# EasyEDA schematic d_00_e_03.json
TITLE: Sheet_1; REV: 1.0; Date: 2021-02-06; Sheet: 1/1; Drawn By: ghusk; Company: Your Company
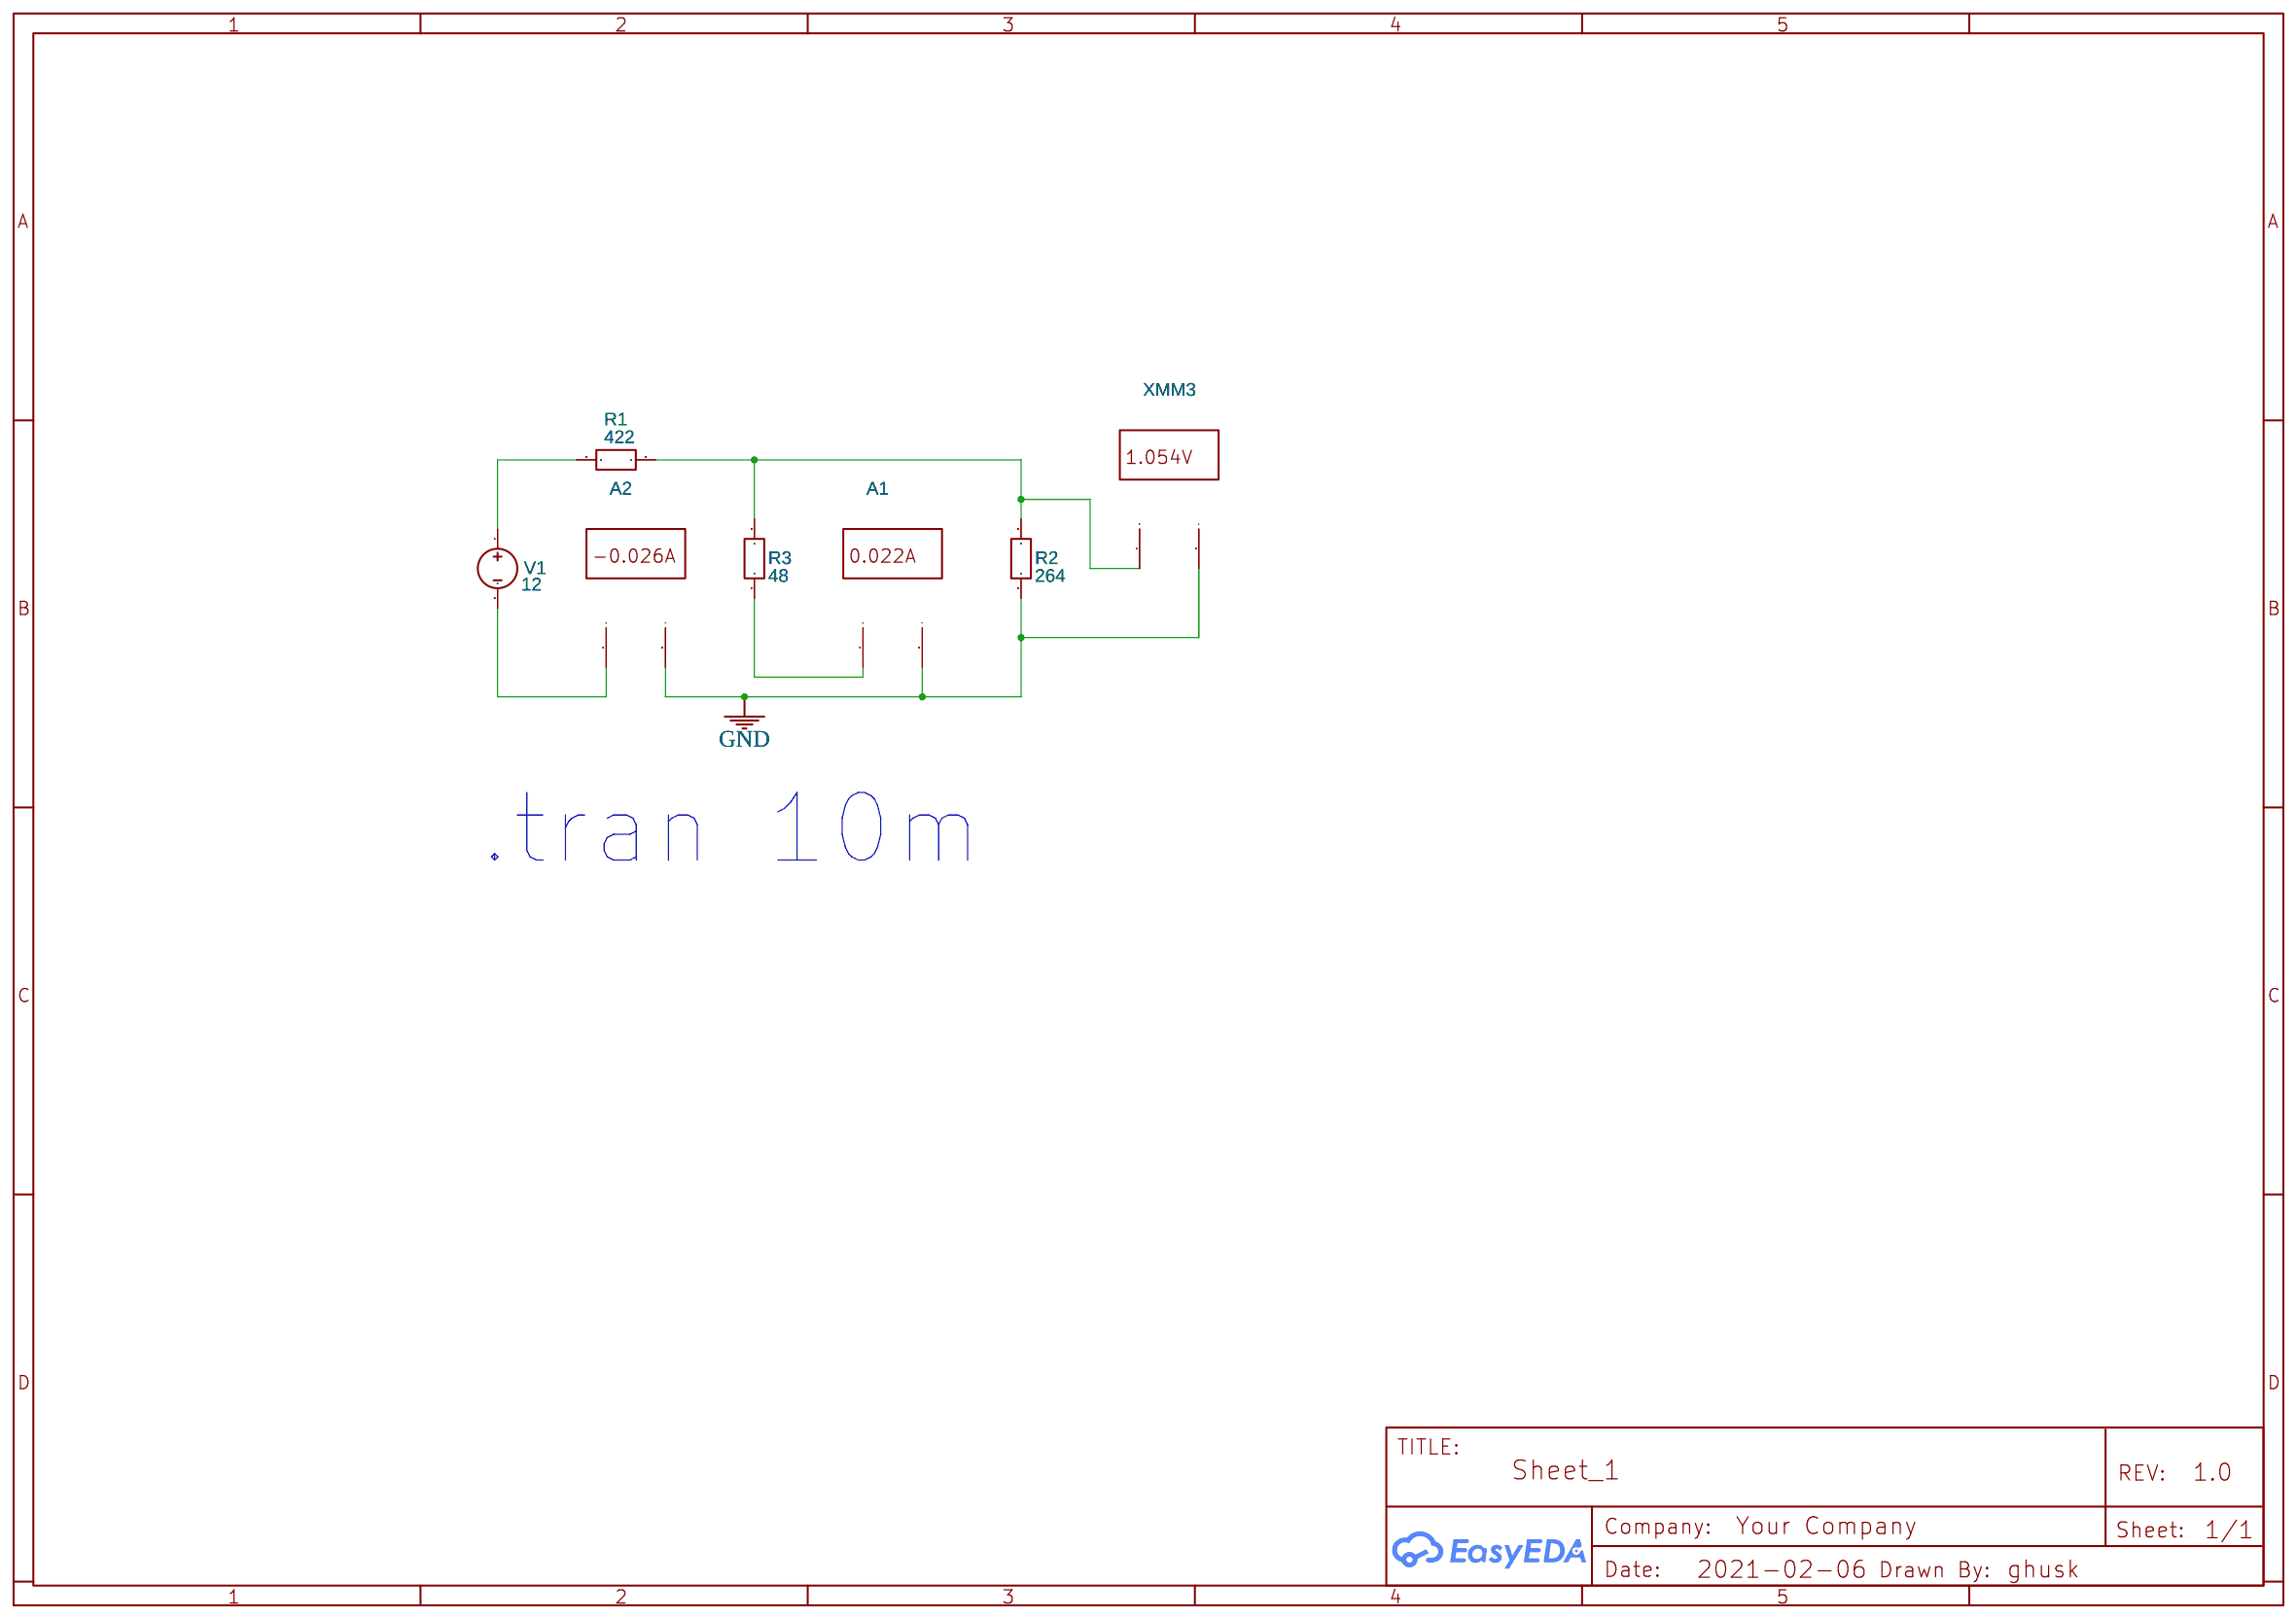
[diagram p0: schematic sheet]

## Parts
A1  Multimeter
A2  Multimeter
R1  422  [AXIAL-0.3]
R2  264  [AXIAL-0.3]
R3  48  [AXIAL-0.3]
V1  12  [HDR1X2]
XMM3  Multimeter

## Library data of the parts
A1 A2 = MULTIMETER: Supplier: LCSC; Multimeter Type: Amper; Power Type: AC; Voltmeter resistance: 10μ; Ammeter resistance: 1G; NameDisplay: 0; Contributor: EasyEDA; sim: true
R1-R3 = Resistor_EU: Contributor: EasyEDA; Resistance: 1K
V1 = VDC: Contributor: EasyEDA; sim: true
XMM3 = MULTIMETER: Supplier: LCSC; Multimeter Type: Voltmeter; Power Type: AC; Voltmeter resistance: 10μ; Ammeter resistance: 1G; NameDisplay: 0; Contributor: EasyEDA; sim: true

## Nets
GND: A1.2(I) A2.2(I) R2.1 XMM3.2(I)
Net-(A1-1): A1.1(+) R3.1
Net-(A2-1): A2.1(+) V1.2
Net-(R1-1): R1.1 V1.1
Net-(R1-2): R1.2 R2.2 R3.2 XMM3.1(+)

## Notes on the sheet
- .tran 10m
